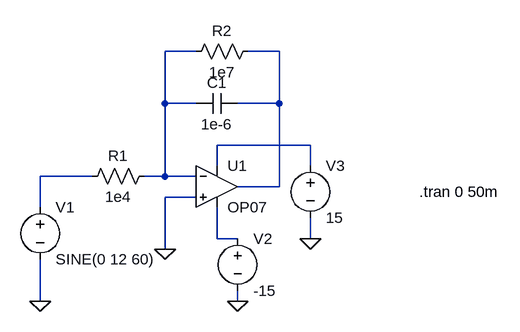
[diagram p0: schematic integrator.asc]
integrator.asc, the LTspice schematic file:
Version 4
SHEET 1 880 680
WIRE 400 0 352 0
WIRE 528 0 480 0
WIRE 352 80 352 0
WIRE 400 80 352 80
WIRE 528 80 528 0
WIRE 528 80 464 80
WIRE 576 144 432 144
WIRE 432 176 432 144
WIRE 576 176 576 144
WIRE 240 192 160 192
WIRE 352 192 352 80
WIRE 352 192 320 192
WIRE 400 192 352 192
WIRE 528 208 528 80
WIRE 528 208 464 208
WIRE 400 224 352 224
WIRE 160 240 160 192
WIRE 432 288 432 240
WIRE 464 288 432 288
WIRE 576 288 576 256
WIRE 352 304 352 224
WIRE 160 384 160 320
WIRE 464 384 464 368
FLAG 160 384 0
FLAG 352 304 0
FLAG 576 288 0
FLAG 464 384 0
SYMBOL Res 336 176 R90
WINDOW 0 0 56 VBottom 2
WINDOW 3 32 56 VTop 2
SYMATTR InstName R1
SYMATTR Value 1e4
SYMBOL Voltage 160 224 R0
SYMATTR InstName V1
SYMATTR Value SINE(0 12 60)
SYMBOL OpAmps/OP07 432 144 R0
SYMATTR InstName U1
SYMBOL Voltage 464 272 R0
SYMATTR InstName V2
SYMATTR Value -15
SYMBOL Voltage 576 160 R0
SYMATTR InstName V3
SYMATTR Value 15
SYMBOL Cap 464 64 R90
WINDOW 0 0 32 VBottom 2
WINDOW 3 32 32 VTop 2
SYMATTR InstName C1
SYMATTR Value 1e-6
SYMBOL Res 496 -16 R90
WINDOW 0 0 56 VBottom 2
WINDOW 3 32 56 VTop 2
SYMATTR InstName R2
SYMATTR Value 1e7
TEXT 744 216 Left 2 !.tran 0 50m

The netlist it stands for:
* integrator.asc
R1 N001 N004 1e4
V1 N004 0 SINE(0 12 60)
XU1 0 N001 N003 N005 N002 LT1001  ; OP07, pins In+ In- V+ V- OUT
V2 N005 0 -15
V3 N003 0 15
C1 N002 N001 1e-6
R2 N002 N001 1e7
.tran 0 50m
.lib LTC.lib
.backanno
.end